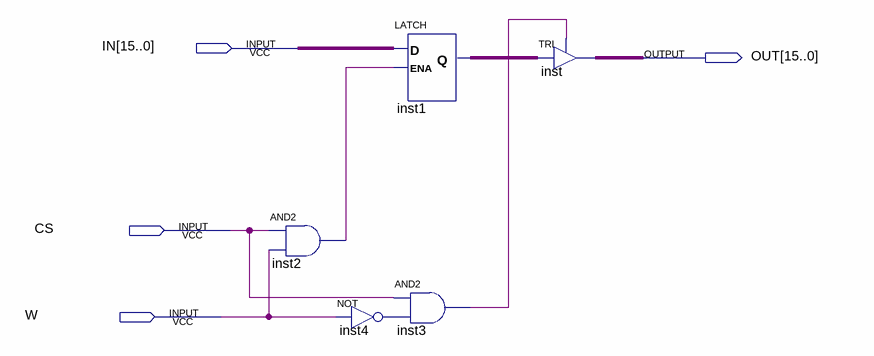
[diagram p0: schematic sheet]
// Quartus schematic WORD16BIT.bdf as structural Verilog: 5 symbols, 4 pins
module WORD16BIT (
  input  [15:0] IN,
  input  CS,
  input  W,
  output [15:0] OUT
);

  wire inst2_out, inst3_out, inst4_out;
  wire [15:0] inst1_q;

  and inst2 (inst2_out, CS, W);
  not inst4 (inst4_out, W);
  LATCH inst1[15:0] (.D(IN), .ENA(inst2_out), .Q(inst1_q));
  and inst3 (inst3_out, CS, inst4_out);
  TRI inst[15:0] (.IN(inst1_q), .OE(inst3_out), .OUT(OUT));
endmodule
